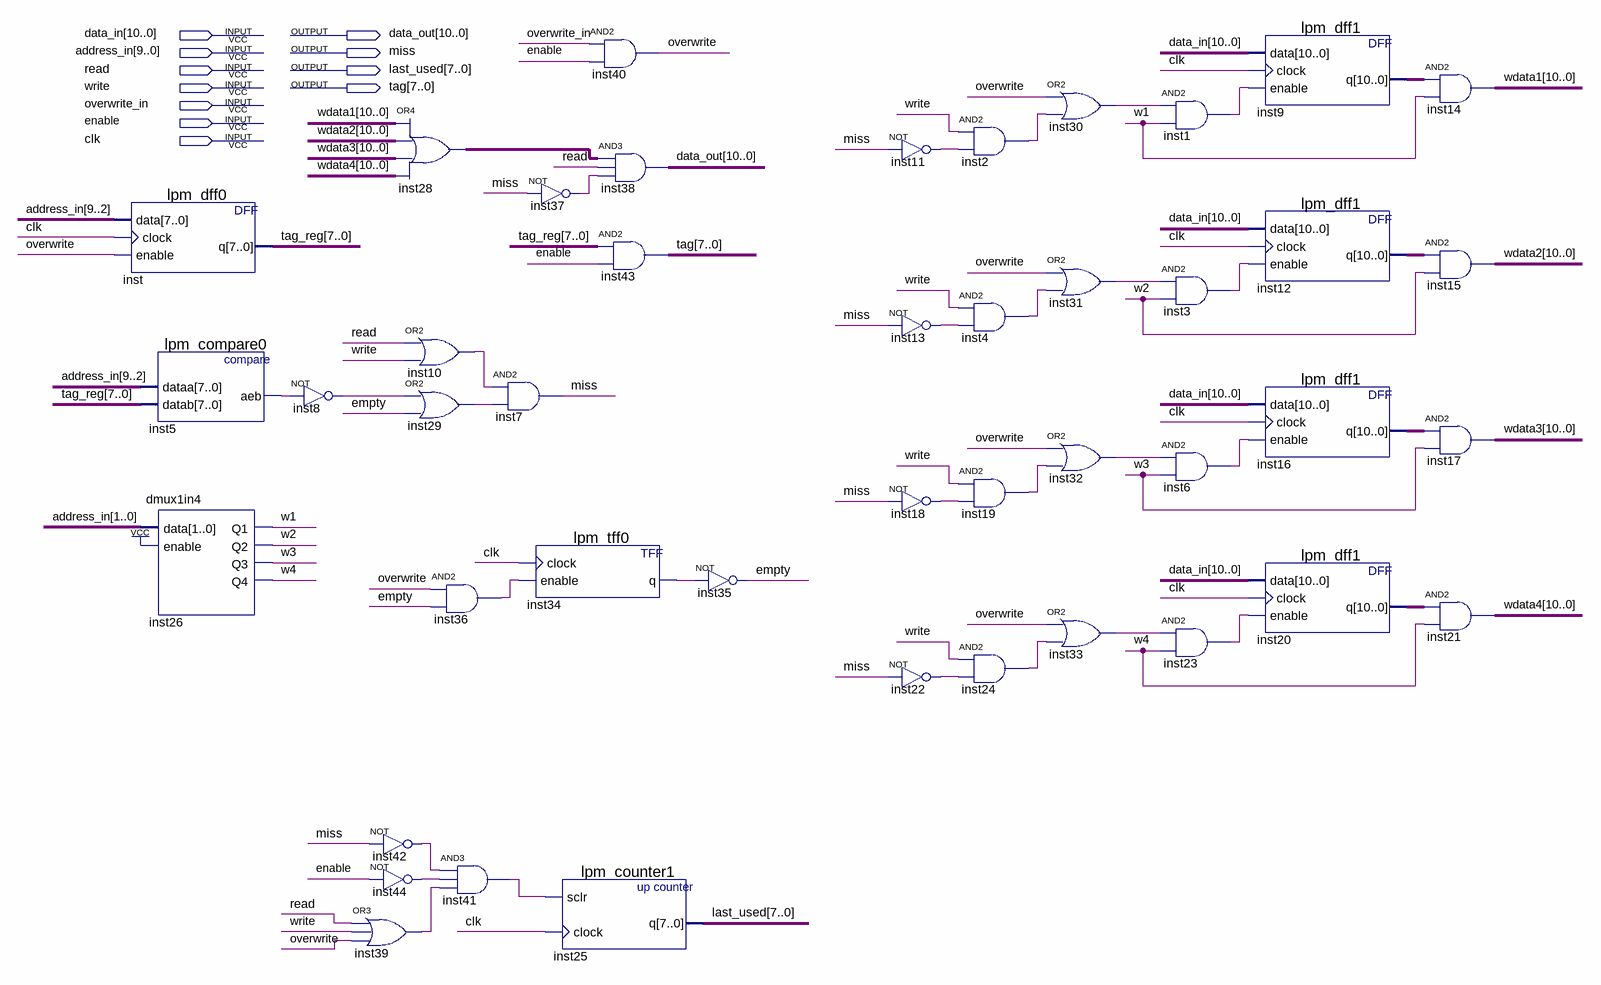
[diagram p0: schematic sheet]
// Quartus schematic block.bdf as structural Verilog: 44 symbols, 11 pins
module block (
  input  [10:0] data_in,
  input  [9:0] address_in,
  input  read,
  input  write,
  input  overwrite_in,
  input  enable,
  input  clk,
  output [10:0] data_out,
  output miss,
  output [7:0] last_used,
  output [7:0] tag
);

  wire empty, inst1_out, inst2_out, inst3_out, inst4_out, inst5_aeb, inst6_out, inst8_out, inst10_out,
       inst11_out, inst13_out, inst18_out, inst19_out, inst22_out, inst23_out, inst24_out, inst29_out,
       inst30_out, inst31_out, inst32_out, inst33_out, inst34_q, inst36_out, inst37_out, inst39_out,
       inst41_out, inst42_out, inst44_out, overwrite, w1, w2, w3, w4;
  wire [7:0] tag_reg;
  wire [10:0] inst9_q, inst12_q, inst16_q, inst20_q, inst28_out, wdata1, wdata2, wdata3, wdata4;

  lpm_dff0 inst (.data(address_in[9:2]), .clock(clk), .enable(overwrite), .q(tag_reg));
  lpm_compare0 inst5 (.dataa(address_in[9:2]), .datab(tag_reg), .aeb(inst5_aeb));
  dmux1in4 inst26 (.data(address_in[1:0]), .enable(1'b1), .Q1(w1), .Q2(w2), .Q3(w3), .Q4(w4));
  not inst8 (inst8_out, inst5_aeb);
  not inst42 (inst42_out, miss);
  not inst44 (inst44_out, enable);
  or inst39 (inst39_out, read, write, overwrite);
  assign inst28_out = wdata1 | wdata2 | wdata3 | wdata4;  // OR4 inst28, 11 bits wide
  or inst10 (inst10_out, read, write);
  or inst29 (inst29_out, inst8_out, empty);
  and inst36 (inst36_out, overwrite, empty);
  and inst41 (inst41_out, inst42_out, inst44_out, inst39_out);
  and inst7 (miss, inst10_out, inst29_out);
  not inst37 (inst37_out, miss);
  lpm_tff0 inst34 (.clock(clk), .enable(inst36_out), .q(inst34_q));
  lpm_counter1 inst25 (.sclr(inst41_out), .clock(clk), .q(last_used));
  and inst40 (overwrite, overwrite_in, enable);
  assign data_out = inst28_out & {11{read}} & {11{inst37_out}};  // AND3 inst38, 11 bits wide
  assign tag = tag_reg & {8{enable}};  // AND2 inst43, 8 bits wide
  not inst35 (empty, inst34_q);
  not inst11 (inst11_out, miss);
  not inst13 (inst13_out, miss);
  not inst18 (inst18_out, miss);
  not inst22 (inst22_out, miss);
  and inst2 (inst2_out, write, inst11_out);
  and inst4 (inst4_out, write, inst13_out);
  and inst19 (inst19_out, write, inst18_out);
  and inst24 (inst24_out, write, inst22_out);
  or inst30 (inst30_out, overwrite, inst2_out);
  or inst31 (inst31_out, overwrite, inst4_out);
  or inst32 (inst32_out, overwrite, inst19_out);
  or inst33 (inst33_out, overwrite, inst24_out);
  and inst1 (inst1_out, inst30_out, w1);
  and inst3 (inst3_out, inst31_out, w2);
  and inst6 (inst6_out, inst32_out, w3);
  and inst23 (inst23_out, inst33_out, w4);
  lpm_dff1 inst9 (.data(data_in), .clock(clk), .enable(inst1_out), .q(inst9_q));
  lpm_dff1 inst12 (.data(data_in), .clock(clk), .enable(inst3_out), .q(inst12_q));
  lpm_dff1 inst16 (.data(data_in), .clock(clk), .enable(inst6_out), .q(inst16_q));
  lpm_dff1 inst20 (.data(data_in), .clock(clk), .enable(inst23_out), .q(inst20_q));
  assign wdata1 = inst9_q & {11{w1}};  // AND2 inst14, 11 bits wide
  assign wdata2 = inst12_q & {11{w2}};  // AND2 inst15, 11 bits wide
  assign wdata3 = inst16_q & {11{w3}};  // AND2 inst17, 11 bits wide
  assign wdata4 = inst20_q & {11{w4}};  // AND2 inst21, 11 bits wide
endmodule
